# Altium project Arduino - FPGA Development Board.PrjPcb (part 2 of 2)

## Sheet Power.SchDoc
size A4
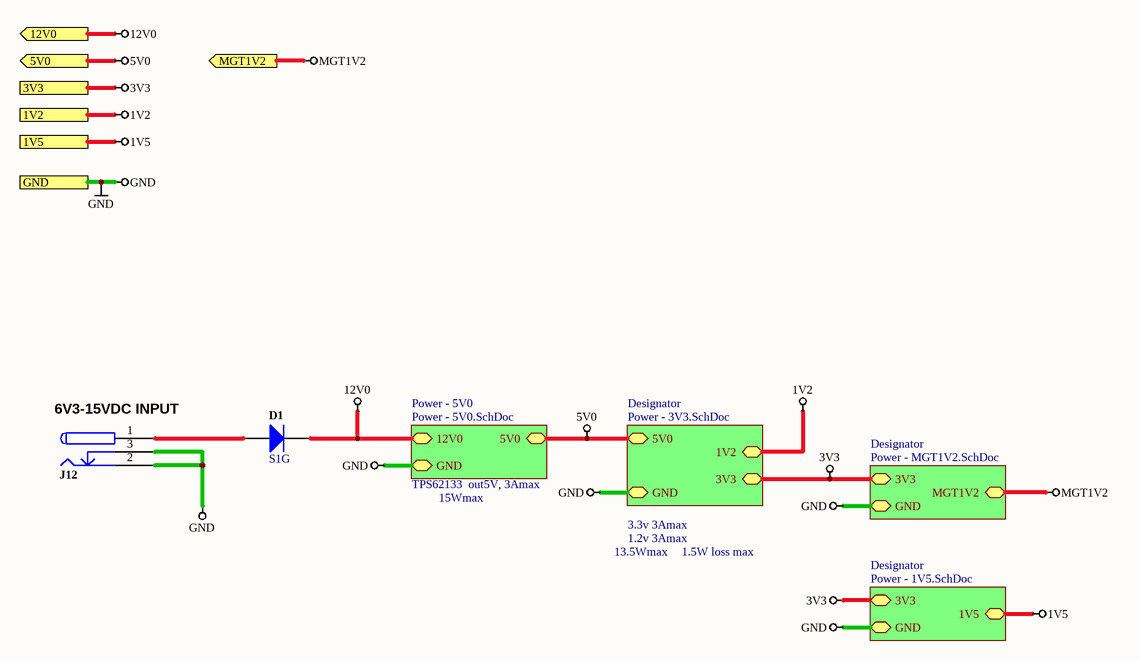
[diagram p10: Power.SchDoc]

### Parts
D1  S1G  [DO-214AC]
J12  PWR CONNECTOR  [PJ-102AH]  (value not drawn)

### Sub-sheets
Designator = Power - 3V3.SchDoc: 5V0, GND, 3V3, 1V2
Designator = Power - MGT1V2.SchDoc: 3V3, GND, MGT1V2
Designator = Power - 1V5.SchDoc: 3V3, GND, 1V5
Power - 5V0 = Power - 5V0.SchDoc: 12V0, GND, 5V0

### Ports
1V2, 1V5, 3V3, 5V0, 12V0, GND, MGT1V2

### Nets
1V2: port 1V2, sheet Designator/1V2
1V5: port 1V5, sheet Designator/1V5
3V3: port 3V3, sheet Designator/3V3, sheet Designator/3V3, sheet Designator/3V3
5V0: port 5V0, sheet Power - 5V0/5V0, sheet Designator/5V0
12V0: D1.2 ; port 12V0, sheet Power - 5V0/12V0
GND: J12.2 J12.3 ; port GND, sheet Power - 5V0/GND, sheet Designator/GND, sheet Designator/GND, sheet Designator/GND  [project net AGND]
MGT1V2: port MGT1V2, sheet Designator/MGT1V2
NetD1_1: D1.1 J12.1

### Notes on the sheet
- (near J12) 6V3-15VDC INPUT
- TPS62133  out5V, 3Amax
- 15Wmax
- 3.3v 3Amax
- 1.2v 3Amax
- 13.5Wmax
- 1.5W loss max

### Library data of the parts
D1 = S1G: Fairchild S1G General Purpose Rectifier; Vrrm: 400V; If(AV): 1.0A; Ifsm: 30A; Pd: 1.4W; Trr: 1.8uS; Ct: 6.6pF; Package: DO-214AC; Manufacturer_PN: S1G; Manufacturer Part Number: S1G
J12 = POWER-CONNECTOR-3: Connector, 3 Conductor Power Jack; Manufacturer_PN: CP-102AH-ND; Connector type: POWERJACK 3 HEADER; ClassName: PWR_CONN_5V0; Category: Connector; Mounting Technology: PTH; Pin Count: 3; Manufacturer Part Number: CP-102AH-ND

## Sheet Power - 5V0.SchDoc
size A4; PageSetup: Record=PageOptions|CenterHorizontal=True|CenterVertical=True|PrintScale=1.00|XCorrection=1.00|YCorrection=1.00|PrintKind=1|BorderSize=5000000|LeftOffset=0|BottomOffset=0|Orientation=2|PaperLength=1000|PaperWidth=1000|Scale=100|PaperSource=7|PrintQuality=-3|MediaType=1|DitherType=10|PrintScaleMode=1|PaperKind=Letter|PaperIndex=119
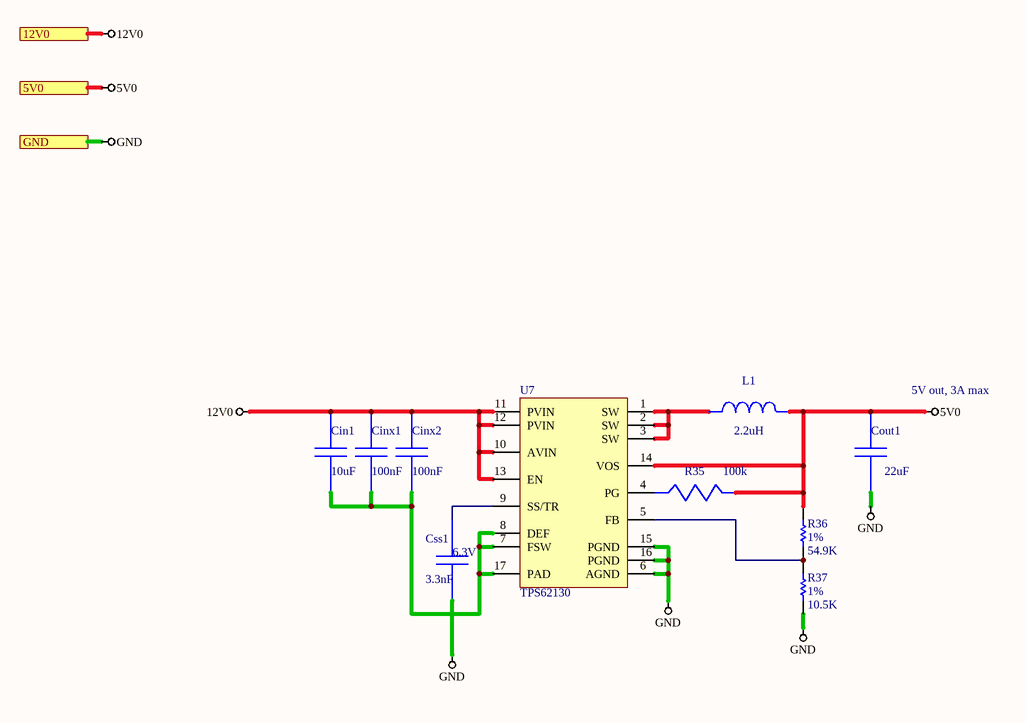
[diagram p11: Power - 5V0.SchDoc]

### Parts
Cin1  value 10uF  [1206]  (hidden comment: GRM31CR61E106KA12L)
Cinx1  value 100nF  [C-0603]  (hidden comment: C0603C104K3RACTU)
Cinx2  value 100nF  [C-0603]  (hidden comment: C0603C104K3RACTU)
Cout1  value 22uF  [C-0805]  (hidden comment: LMK212BJ226MG-T)
Css1  6.3V  value 3.3nF  [CAPC0402(1005)60_L]
L1  value 2.2uH  [XAL4020]  (hidden comment: XAL4020-222MEB)
R35  value 100k  [CAPC0402(1005)60_L]  (hidden comment: CRCW0402100KFKED)
R36  1%  value 54.9K  [RESC0402(1005)40_L]
R37  1%  value 10.5K  [RESC0402(1005)40_L]
U7  TPS62130  [S-PVQFN-N16]

### Ports
5V0, 12V0, GND

### Nets
5V0: Cout1.1 L1.2 R35.1 R36.2 U7.14(VOS) ; port 5V0
12V0: Cin1.1 Cinx1.1 Cinx2.1 U7.10(AVIN) U7.11(PVIN) U7.12(PVIN) U7.13(EN) ; port 12V0
GND: Cout1.2 Css1.2 R37.1 U7.6(AGND) U7.15(PGND) U7.16(PGND) ; port GND  [project net AGND]
NetCin1_2: Cin1.2 Cinx1.2 Cinx2.2 U7.7(FSW) U7.8(DEF) U7.17(PAD)
NetCss1_1: Css1.1 U7.9(SS/TR)
NetL1_1: L1.1 U7.1(SW) U7.2(SW) U7.3(SW)
NetR35_2: R35.2 U7.4(PG)
NetR36_1: R36.1 R37.2 U7.5(FB)

### Notes on the sheet
- (near Cout1) 5V out, 3A max

### Library data of the parts
Cin1 = GRM31CR61E106KA12L: GRM31CR61E106KA1; Manufacturer Name: MuRata; PackageReference: GRM31CR61E106KA12L; Manufacturer Part Number: GRM31CR61E106KA12L
Cinx1 Cinx2 = C0603C104K3RACTU: Manufacturer Name: Kemet; PackageReference: C0603C104K3RACTU; Manufacturer Part Number: C0603C104K3RACTU
Cout1 = LMK212BJ226MG-T: Manufacturer Name: Taiyo Yuden; PackageReference: LMK212BJ226MG-T; Manufacturer Part Number: LMK212BJ226MG-T
Css1 = GRM1555C1E621JA01D: GRM022R60J332KE19D; Manufacturer Name: MuRata; PackageReference: GRM022R60J332KE19D; Manufacturer Part Number: GRM022R60J332KE19D
L1 = XAL4020-222MEB: Manufacturer Name: Coilcraft; PackageReference: XAL4020-222MEB; Manufacturer Part Number: XAL4020-222MEB
R35 = CRCW0402100KFKED: Manufacturer Name: Vishay-Dale; PackageReference: CRCW0402100KFKED; Manufacturer Part Number: CRCW0402100KFKED
R36 R37 = Res1: Resistor; Published: 8-Jun-2000; LatestRevisionDate: 17-Jul-2002; LatestRevisionNote: Re-released for DXP Platform.; PackageReference: AXIAL-0.3; Publisher: Altium Limited; PackageDescription: Axial Device, Thru-Hole; 2 Leads; 0.3 in Pin Spacing
U7 = TPS6213X

## Sheet Power - 3V3.SchDoc
size A4
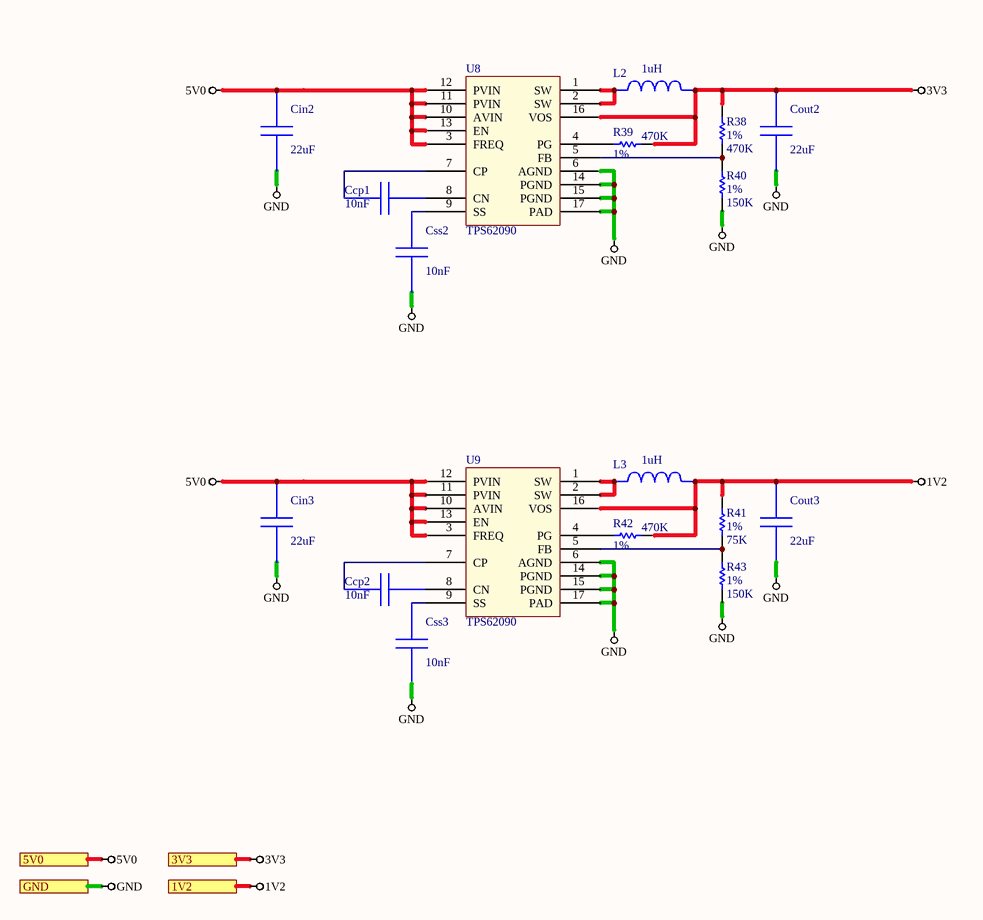
[diagram p12: Power - 3V3.SchDoc]

### Parts
Ccp1  value 10nF  [CAPC0402(1005)60_L]  (hidden comment: GRM155R71E103KA01D)
Ccp2  value 10nF  [CAPC0402(1005)60_L]  (hidden comment: GRM155R71E103KA01D)
Cin2  value 22uF  [C-0805]  (hidden comment: GRM21BR60J226ME39L)
Cin3  value 22uF  [C-0805]  (hidden comment: GRM21BR60J226ME39L)
Cout2  value 22uF  [C-0805]  (hidden comment: GRM21BR60J226ME39L)
Cout3  value 22uF  [C-0805]  (hidden comment: GRM21BR60J226ME39L)
Css2  value 10nF  [CAPC0402(1005)60_L]  (hidden comment: GRM155R71E103KA01D)
Css3  value 10nF  [CAPC0402(1005)60_L]  (hidden comment: GRM155R71E103KA01D)
L2  value 1uH  [XFL4020]  (hidden comment: XFL4020-102MEB)
L3  value 1uH  [XFL4020]  (hidden comment: XFL4020-102MEB)
R38  1%  value 470K  [RESC0402(1005)40_L]
R39  1%  value 470K  [RESC0402(1005)40_L]
R40  1%  value 150K  [RESC0402(1005)40_L]
R41  1%  value 75K  [RESC0402(1005)40_L]
R42  1%  value 470K  [RESC0402(1005)40_L]
R43  1%  value 150K  [RESC0402(1005)40_L]
U8  TPS62090  [RGT16_1P7X1P7]
U9  TPS62090  [RGT16_1P7X1P7]

### Ports
1V2, 3V3, 5V0, GND

### Nets
1V2: Cout3.1 L3.2 R41.2 R42.1 U9.16(VOS) ; port 1V2
3V3: Cout2.1 L2.2 R38.2 R39.1 U8.16(VOS) ; port 3V3
5V0: Cin2.1 Cin3.1 U8.3(FREQ) U8.10(AVIN) U8.11(PVIN) U8.12(PVIN) U8.13(EN) U9.3(FREQ) U9.10(AVIN) U9.11(PVIN) U9.12(PVIN) U9.13(EN) ; port 5V0
GND: Cin2.2 Cin3.2 Cout2.2 Cout3.2 Css2.2 Css3.2 R40.1 R43.1 U8.6(AGND) U8.14(PGND) U8.15(PGND) U8.17(PAD) U9.6(AGND) U9.14(PGND) U9.15(PGND) U9.17(PAD) ; port GND  [project net AGND]
NetCcp1_1: Ccp1.1 U8.7(CP)
NetCcp1_2: Ccp1.2 U8.8(CN)
NetCcp2_1: Ccp2.1 U9.7(CP)
NetCcp2_2: Ccp2.2 U9.8(CN)
NetCss2_1: Css2.1 U8.9(SS)
NetCss3_1: Css3.1 U9.9(SS)
NetL2_1: L2.1 U8.1(SW) U8.2(SW)
NetL3_1: L3.1 U9.1(SW) U9.2(SW)
NetR38_1: R38.1 R40.2 U8.5(FB)
NetR39_2: R39.2 U8.4(PG)
NetR41_1: R41.1 R43.2 U9.5(FB)
NetR42_2: R42.2 U9.4(PG)

### Library data of the parts
Ccp1 Ccp2 Css2 Css3 = GRM155R71E103KA01D: GRM155R71E103KA0; Manufacturer Name: MuRata; PackageReference: GRM155R71E103KA01D; Manufacturer Part Number: GRM155R71E103KA01D
Cin2 Cin3 Cout2 Cout3 = GRM21BR60J226ME39L: GRM21BR60J226ME3; Manufacturer Name: MuRata; PackageReference: GRM21BR60J226ME39L; Manufacturer Part Number: GRM21BR60J226ME39L
L2 L3 = Inductor-XFL4020-102MEB: Manufacturer Name: Coilcraft; Manufacturer Part Number: XFL4020-102MEB
R38-R43 = Res1: Resistor; Published: 8-Jun-2000; LatestRevisionDate: 17-Jul-2002; LatestRevisionNote: Re-released for DXP Platform.; PackageReference: AXIAL-0.3; Publisher: Altium Limited; PackageDescription: Axial Device, Thru-Hole; 2 Leads; 0.3 in Pin Spacing
U8 U9 = TPS6209X

## Sheet Power - MGT1V2.SchDoc
size A4
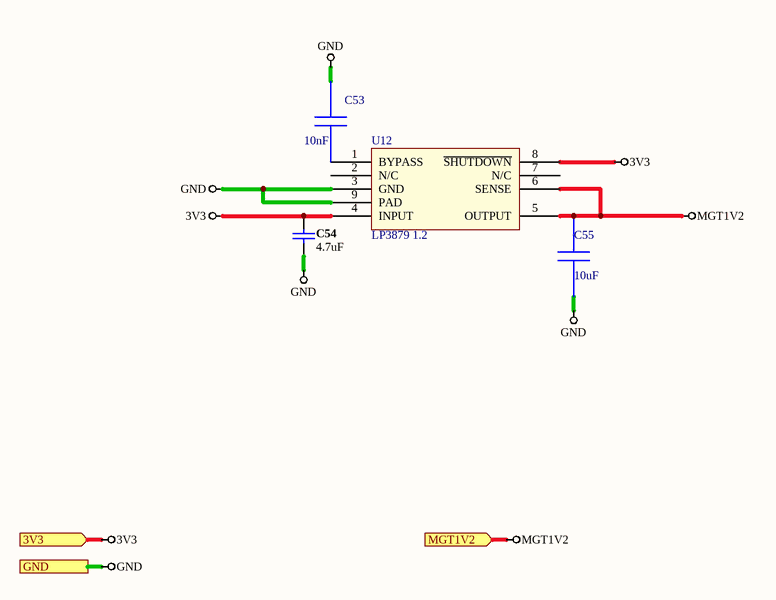
[diagram p13: Power - MGT1V2.SchDoc]

### Parts
C53  value 10nF  [CAPC0402(1005)60_L]  (hidden comment: GRM155R71E103KA01D)
C54  value 4.7uF  [CAPC0603(1608)55_L]  (hidden comment: CAP 4.7uF 10V 0603(1608))
C55  value 10uF  [1206]  (hidden comment: GRM31CR61E106KA12L)
U12  LP3879 1.2  [MRA08A]

### Ports
3V3, GND, MGT1V2

### Nets
3V3: C54.2 U12.4(INPUT) U12.8(~{SHUTDOWN}) ; port 3V3
GND: C53.1 C54.1 C55.2 U12.3(GND) U12.9(PAD) ; port GND  [project net AGND]
MGT1V2: C55.1 U12.5(OUTPUT) U12.6(SENSE) ; port MGT1V2
NetC53_2: C53.2 U12.1(BYPASS)

Not connected (* = marked no-connect by the designer): U12 2(N/C) 7(N/C)

### Library data of the parts
C53 = GRM155R71E103KA01D: as Ccp1 on sheet Power - 3V3; PackageReference: GRM155R71E103KA01D; Manufacturer Part Number: GRM155R71E103KA01D
C54 = CAP 4.7uF 10V ±10% 0603 (1608 Metric) Thickness 0.55mm SMD: Manufacturer_PN: CC0603KRX5R6BB475; Case-Metric: 1608; Case-EIA: 0603; Tolerance: ±10%; Rated Voltage: 10 V; Technology: SMT; Max Thickness: 0.55 mm; Manufacturer Part Number: CC0603KRX5R6BB475
C55 = GRM31CR61E106KA12L: as Cin1 on sheet Power - 5V0; PackageReference: GRM31CR61E106KA12L; Manufacturer Part Number: GRM31CR61E106KA12L
U12 = LP3879

## Sheet Power - 1V5.SchDoc
size A4
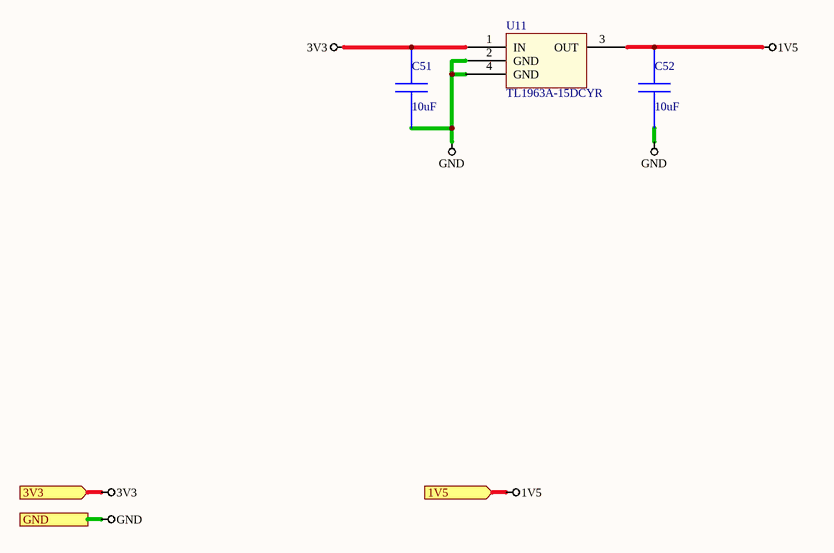
[diagram p14: Power - 1V5.SchDoc]

### Parts
C51  value 10uF  [1206]  (hidden comment: GRM31CR61E106KA12L)
C52  value 10uF  [1206]  (hidden comment: GRM31CR61E106KA12L)
U11  TL1963A-15DCYR  [DCY4]

### Ports
1V5, 3V3, GND

### Nets
1V5: C52.1 U11.3(OUT) ; port 1V5
3V3: C51.1 U11.1(IN) ; port 3V3
GND: C51.2 C52.2 U11.2(GND) U11.4(GND) ; port GND  [project net AGND]

### Library data of the parts
C51 C52 = GRM31CR61E106KA12L: as Cin1 on sheet Power - 5V0; PackageReference: GRM31CR61E106KA12L; Manufacturer Part Number: GRM31CR61E106KA12L

## Sheet LEDS - Status.SchDoc
size A4
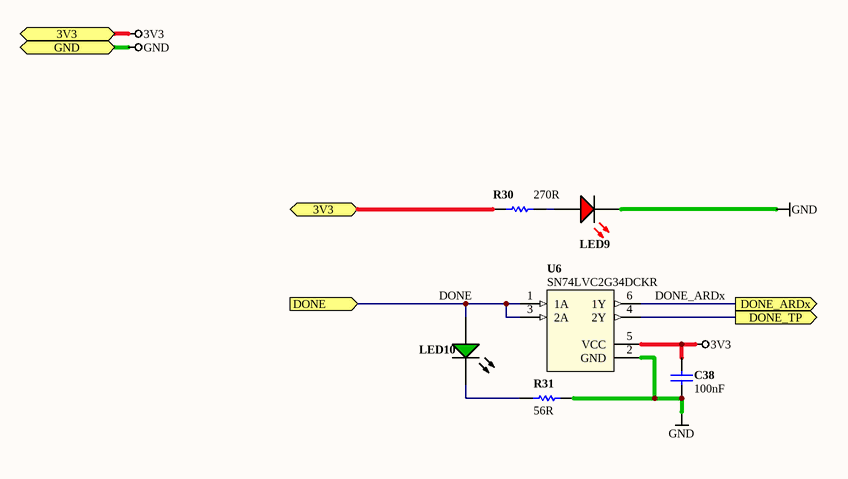
[diagram p15: LEDS - Status.SchDoc]

### Parts
C38  value 100nF  [CAPC0402(1005)60_L]  (hidden comment: CAP 100nF 10V 0402(1005))
LED9  0402-LED-RED  [LED_0402]  (value not drawn)
LED10  LED_GREEN_APT1608SGC  [LED0603]  (value not drawn)
R30  value 270R  [RESC0402(1005)40_L]  (hidden comment: 270R 1 0402)
R31  value 56R  [RESC0402(1005)_L]  (hidden comment: 56R 1% 0402(1005))
U6  SN74LVC2G34DCKR  [TI-DCK6_L]

### Ports
3V3, DONE (in), DONE_ARDx (out), DONE_TP (out), GND

### Nets
3V3: C38.2 R30.1 U6.5(VCC) ; port 3V3
GND: C38.1 LED9.2(K) R31.2 U6.2(GND) ; port GND  [project net AGND]
DONE: LED10.1(A) U6.1(1A) U6.3(2A) ; port DONE
DONE_ARDx: U6.6(1Y) ; port DONE_ARDx
NetLED9_1: LED9.1(A) R30.2
NetLED10_2: LED10.2(K) R31.1
NetU6_4: U6.4(2Y) ; port DONE_TP

### Library data of the parts
C38 = CMP-1034-02064-1: CAP 100nF 10V ±5% 0402 (1005 Metric) Thickness 0.6mm SMD; Manufacturer_PN: C0402C104K8PACTU; Case-EIA: 0402; Case-Metric: 1005; Max Thickness: 0.6 mm; Tolerance: ±5%; Rated Voltage: 10 V; Technology: SMT; Manufacturer Part Number: C0402C104K8PACTU
LED9 = CMP-0201-0013: 0402 LED,RED; Manufacturer_PN: LTST-C190KRKT; DefaultDesignator: LED?; Class: Diodes; Current Average (Io): 1.8V; ID: CMP-0201-0013; Sub Class: LED; Reverse Voltage DC (Vr): Red; ComponentLink1Description: Datasheet; ComponentLink1URL: http://optoelectronics.liteon.com/upload/download/DS-22-99-0151/S_110_LTST-C190KRKT.pdf; ComponentLink2Description: Manufacturer; ComponentLink2URL: www.liteon.com; Manufacturer Part Number: LTST-C190KRKT
LED10 = LED_GREEN_APT1608SGC: SMD 0603 LED, GREEN; DefaultDesignator: LED?; Class: Diodes; Forward Voltage (Vf): 2.2V; PartNumber: APT1608SGC; Sub Class: LED; Color: Green; Manufacturer_PN: APT1608SGC; Manufacturer Part Number: APT1608SGC
R30 = CMP-0503-0059: 0402 (1005 Metric) 1/16 W 270R 1 Thick Film Chip Resistor; Manufacturer_PN: RC1005F271CS; Case-EIA: 0402; Case-Metric: 1005; Temp Coefficient ppm/°C: ±100; Tolerance %: 1%; Value (Ohms): 270; Power: 1/16 W; ID: CMP-0503-0059; Technology: SMT; Manufacturer Part Number: RC1005F271CS
R31 = CMP-1011-00369-1: 56R 0.063W 1% 0402 (1005 Metric)  SMD; Manufacturer_PN: RC0402FR-0756RL; Case-Metric: 1005; Case-EIA: 0402; Power: 0.063 W; Tolerance: 1 %; Technology: SMT; Manufacturer Part Number: RC0402FR-0756RL
U6 = SN74LVC2G34DCKR: IC BUFFER DUAL NON-INV SC706; Manufacturer: Texas Instruments; DefaultDesignator: U?; Class: Logic; Sub Class: Buffer-Line Driver; Description2: IC BUFF/DVR TRI-ST OCTAL 20-VQFN; Logic Type: Buffer/Line Driver, Non-Inverting; Number of Elements: 2; Number of Bits per Element: 4; Current - Output High, Low: 24mA, 24mA; Voltage - Supply: 1.65 V ~ 3.6 V; PartNumber: SN74LVC2G34DCKR; ComponentLink1Description: Datasheet; ComponentLink1URL: http://www.ti.com/lit/ds/symlink/sn74lvc2g34.pdf; ComponentLink2Description: Manufacturer; ComponentLink2URL: www.ti.com; Series: 74LVC; Operating Temperature: -40°C ~ 125°C; Manufacturer_PN: SN74LVC2G34DCKR; Manufacturer Part Number: SN74LVC2G34DCKR

## Nets that join several sheets
1V5: PCIE - mini-pcie-connector (5 pins), Power - 1V5 (C52.1 U11.3)
3V3: Arduino FPGA Top-Level Interface (J1.9 J9.2), Arduino FPGA Design (C8.1 R19.2 U2.4), FPGA - XC6SLX45T-2CSG324C (10 pins), PCIE - mini-pcie-connector (11 pins), GPS - NEO-M8T (5 pins), Power - 3V3 (5 pins), Power - MGT1V2 (C54.2 U12.4 U12.8), Power - 1V5 (C51.1 U11.1), LEDS - Status (C38.2 R30.1 U6.5)
5V0: Arduino FPGA Top-Level Interface (J10.2), Power - 5V0 (5 pins), Power - 3V3 (12 pins)
12V0: Arduino FPGA Top-Level Interface (J11.2), Power (D1.2), Power - 5V0 (7 pins)
AGND: Arduino FPGA Top-Level Interface (13 pins), Arduino FPGA Design (C8.2 R18.1 U2.2), Flash - M25P32-VMW6TG (C10.2 U4.4), FPGA - XC6SLX45T-2CSG324C (27 pins), FPGA - Decoupling (69 pins), Arduino FPGA SPI MUX (C9.2 U3.8), SRAM0 - IS61WV12816DBLL-10BLI (6 pins), PCIE - mini-pcie-connector (19 pins), GPS - NEO-M8T (15 pins), Power (J12.2 J12.3), Power - 5V0 (6 pins), Power - 3V3 (16 pins), Power - MGT1V2 (5 pins), Power - 1V5 (C51.2 C52.2 U11.2 U11.4), LEDS - Status (C38.1 LED9.2 R31.2 U6.2)
MGT1V2: FPGA - XC6SLX45T-2CSG324C (14 pins), Power - MGT1V2 (C55.1 U12.5 U12.6)
PWR: Flash - M25P32-VMW6TG (C10.1 R28.2 R29.2 U4.8), Arduino FPGA SPI MUX (C9.1 U3.16), SRAM0 - IS61WV12816DBLL-10BLI (6 pins)
ARD_A0: Arduino FPGA Top-Level Interface (J7.1), FPGA - XC6SLX45T-2CSG324C (U1.C15)
ARD_A1: Arduino FPGA Top-Level Interface (J7.2), FPGA - XC6SLX45T-2CSG324C (U1.D15)
ARD_A2: Arduino FPGA Top-Level Interface (J7.3), FPGA - XC6SLX45T-2CSG324C (U1.E14)
ARD_A3: Arduino FPGA Top-Level Interface (J7.4), FPGA - XC6SLX45T-2CSG324C (U1.F12)
ARD_A4: Arduino FPGA Top-Level Interface (J7.5), FPGA - XC6SLX45T-2CSG324C (U1.E12)
ARD_A5: Arduino FPGA Top-Level Interface (J7.6), FPGA - XC6SLX45T-2CSG324C (U1.G11)
ARD_D0(RX): Arduino FPGA Top-Level Interface (J5.1), FPGA - XC6SLX45T-2CSG324C (U1.C1)
ARD_D1(TX): Arduino FPGA Top-Level Interface (J5.2), FPGA - XC6SLX45T-2CSG324C (U1.C2)
ARD_D4: Arduino FPGA Top-Level Interface (J5.5), FPGA - XC6SLX45T-2CSG324C (U1.D1)
ARD_D5: Arduino FPGA Top-Level Interface (J5.6), FPGA - XC6SLX45T-2CSG324C (U1.D2)
ARD_D6: Arduino FPGA Top-Level Interface (J5.7), FPGA - XC6SLX45T-2CSG324C (U1.E1)
ARD_D7: Arduino FPGA Top-Level Interface (J5.8), FPGA - XC6SLX45T-2CSG324C (U1.F1)
ARD_D8: Arduino FPGA Top-Level Interface (J6.1), FPGA - XC6SLX45T-2CSG324C (U1.F2)
ARD_D9: Arduino FPGA Top-Level Interface (J6.2), FPGA - XC6SLX45T-2CSG324C (U1.G1)
ARD_D10: Arduino FPGA Top-Level Interface (J6.3), FPGA - XC6SLX45T-2CSG324C (U1.H1), Arduino FPGA SPI MUX (U3.13)
ARD_D11: Arduino FPGA Top-Level Interface (J6.4), FPGA - XC6SLX45T-2CSG324C (U1.H2)
ARD_D12: Arduino FPGA Top-Level Interface (J6.5), FPGA - XC6SLX45T-2CSG324C (U1.J1)
ARD_D13: Arduino FPGA Top-Level Interface (J6.6), FPGA - XC6SLX45T-2CSG324C (U1.K1)
CCLK: FPGA - XC6SLX45T-2CSG324C (R1.1 R3.2 U1.R15), Arduino FPGA SPI MUX (U3.11)
CS_FL_N: Flash - M25P32-VMW6TG (U4.1), Arduino FPGA SPI MUX (U3.12)
CSO_B_FPGA: FPGA - XC6SLX45T-2CSG324C (R17.1 U1.V3), Arduino FPGA SPI MUX (U3.14)
D_SEL: FPGA - XC6SLX45T-2CSG324C (U1.V4), GPS - NEO-M8T (U10.2)
DONE: FPGA - XC6SLX45T-2CSG324C (R9.1 U1.V17), LEDS - Status (LED10.1 U6.1 U6.3)
GPS_RESET: FPGA - XC6SLX45T-2CSG324C (U1.R10), GPS - NEO-M8T (R46.2 U10.8)
HARD_TCK: Arduino FPGA Top-Level Interface (J1.1), FPGA - XC6SLX45T-2CSG324C (R4.1 R11.1)
HARD_TDI: Arduino FPGA Top-Level Interface (J1.3), FPGA - XC6SLX45T-2CSG324C (R5.1 R12.1)
HARD_TDO: Arduino FPGA Top-Level Interface (J1.5), FPGA - XC6SLX45T-2CSG324C (R6.1 R13.1)
HARD_TMS: Arduino FPGA Top-Level Interface (J1.7), FPGA - XC6SLX45T-2CSG324C (R7.1 R14.1)
HOLD_N: Arduino FPGA Top-Level Interface (TP3.1), Flash - M25P32-VMW6TG (R29.1 U4.7)
INIT_B: Arduino FPGA Top-Level Interface (TP4.1), FPGA - XC6SLX45T-2CSG324C (R16.1 U1.U3)
IO0: Arduino FPGA Top-Level Interface (R20.2), FPGA - XC6SLX45T-2CSG324C (U1.U8)
IO1: Arduino FPGA Top-Level Interface (R21.2), FPGA - XC6SLX45T-2CSG324C (U1.V16)
IO2: Arduino FPGA Top-Level Interface (R22.2), FPGA - XC6SLX45T-2CSG324C (U1.V14)
IO3: Arduino FPGA Top-Level Interface (R23.2), FPGA - XC6SLX45T-2CSG324C (U1.V13)
IO4: Arduino FPGA Top-Level Interface (R24.2), FPGA - XC6SLX45T-2CSG324C (U1.V12)
IO5: Arduino FPGA Top-Level Interface (R25.2), FPGA - XC6SLX45T-2CSG324C (U1.U11)
IO6: Arduino FPGA Top-Level Interface (R26.2), FPGA - XC6SLX45T-2CSG324C (U1.V9)
IO7: Arduino FPGA Top-Level Interface (R27.2), FPGA - XC6SLX45T-2CSG324C (U1.V10)
MISO_ARD: Arduino FPGA Top-Level Interface (J2.1), FPGA - XC6SLX45T-2CSG324C (U1.A15), Arduino FPGA SPI MUX (U3.3)
MISO_FL: Flash - M25P32-VMW6TG (U4.2), Arduino FPGA SPI MUX (U3.4)
MISO_FPGA: FPGA - XC6SLX45T-2CSG324C (U1.R13), Arduino FPGA SPI MUX (U3.2)
MOSI_ARD: Arduino FPGA Top-Level Interface (J2.4), FPGA - XC6SLX45T-2CSG324C (U1.B16), Arduino FPGA SPI MUX (U3.6)
MOSI_FL: Flash - M25P32-VMW6TG (U4.5), Arduino FPGA SPI MUX (U3.7)
MOSI_FPGA: FPGA - XC6SLX45T-2CSG324C (U1.T13), Arduino FPGA SPI MUX (U3.5)
MUX_SEL: Arduino FPGA Top-Level Interface (J5.3), Arduino FPGA Design (R18.2), FPGA - XC6SLX45T-2CSG324C (U1.U1)
PCIE_CLK_N: FPGA - XC6SLX45T-2CSG324C (U1.A8), PCIE - mini-pcie-connector (CN1.11)
PCIE_CLK_P: FPGA - XC6SLX45T-2CSG324C (U1.B8), PCIE - mini-pcie-connector (CN1.13)
PCIE_PERST: FPGA - XC6SLX45T-2CSG324C (U1.A3), PCIE - mini-pcie-connector (CN1.22 R34.2)
PCIE_RX0_N: FPGA - XC6SLX45T-2CSG324C (U1.C5), PCIE - mini-pcie-connector (CN1.23)
PCIE_RX0_P: FPGA - XC6SLX45T-2CSG324C (U1.D5), PCIE - mini-pcie-connector (CN1.25)
PCIE_SMB_CLK: FPGA - XC6SLX45T-2CSG324C (U1.E8), PCIE - mini-pcie-connector (CN1.30)
PCIE_SMB_DATA: FPGA - XC6SLX45T-2CSG324C (U1.G9), PCIE - mini-pcie-connector (CN1.32)
PCIE_TX0_N: FPGA - XC6SLX45T-2CSG324C (U1.A4), PCIE - mini-pcie-connector (C42.1)
PCIE_TX0_P: FPGA - XC6SLX45T-2CSG324C (U1.B4), PCIE - mini-pcie-connector (C43.1)
PCIE_USB_DN: FPGA - XC6SLX45T-2CSG324C (U1.F7), PCIE - mini-pcie-connector (CN1.36)
PCIE_USB_DP: FPGA - XC6SLX45T-2CSG324C (U1.E6), PCIE - mini-pcie-connector (CN1.38)
PCIE_W_DISABLE: FPGA - XC6SLX45T-2CSG324C (U1.A2), PCIE - mini-pcie-connector (CN1.20 R33.2)
PCIE_WAKE: FPGA - XC6SLX45T-2CSG324C (U1.B3), PCIE - mini-pcie-connector (CN1.1 R32.2)
PROGRAM_B: Arduino FPGA Top-Level Interface (J5.4), FPGA - XC6SLX45T-2CSG324C (R8.1 U1.V2)
RxD_SPI_MOSI: FPGA - XC6SLX45T-2CSG324C (U1.V5), GPS - NEO-M8T (U10.21)
SCL_SPI_CLK: FPGA - XC6SLX45T-2CSG324C (U1.U5), GPS - NEO-M8T (U10.19)
SCLK_ARD: Arduino FPGA Top-Level Interface (J2.3), FPGA - XC6SLX45T-2CSG324C (U1.A16), Arduino FPGA SPI MUX (U3.10)
SCLK_FL: Flash - M25P32-VMW6TG (U4.6), Arduino FPGA SPI MUX (U3.9)
SDA_SPI_CS_N: FPGA - XC6SLX45T-2CSG324C (U1.V6), GPS - NEO-M8T (U10.18)
SRAM0_CS_N: FPGA - XC6SLX45T-2CSG324C (U1.F16), SRAM0 - IS61WV12816DBLL-10BLI (U5.B5)
SRAM0_HBE_N: FPGA - XC6SLX45T-2CSG324C (U1.L15), SRAM0 - IS61WV12816DBLL-10BLI (U5.B2)
SRAM0_LBE_N: FPGA - XC6SLX45T-2CSG324C (U1.L16), SRAM0 - IS61WV12816DBLL-10BLI (U5.A1)
SRAM0_OE_N: FPGA - XC6SLX45T-2CSG324C (U1.K16), SRAM0 - IS61WV12816DBLL-10BLI (U5.A2)
SRAM0_WE_N: FPGA - XC6SLX45T-2CSG324C (U1.P17), SRAM0 - IS61WV12816DBLL-10BLI (U5.G5)
SRAM_A0: FPGA - XC6SLX45T-2CSG324C (U1.J16), SRAM0 - IS61WV12816DBLL-10BLI (U5.A3)
SRAM_A1: FPGA - XC6SLX45T-2CSG324C (U1.H15), SRAM0 - IS61WV12816DBLL-10BLI (U5.A4)
SRAM_A2: FPGA - XC6SLX45T-2CSG324C (U1.F17), SRAM0 - IS61WV12816DBLL-10BLI (U5.A5)
SRAM_A3: FPGA - XC6SLX45T-2CSG324C (U1.H16), SRAM0 - IS61WV12816DBLL-10BLI (U5.B3)
SRAM_A4: FPGA - XC6SLX45T-2CSG324C (U1.F18), SRAM0 - IS61WV12816DBLL-10BLI (U5.B4)
SRAM_A5: FPGA - XC6SLX45T-2CSG324C (U1.K15), SRAM0 - IS61WV12816DBLL-10BLI (U5.C3)
SRAM_A6: FPGA - XC6SLX45T-2CSG324C (U1.G16), SRAM0 - IS61WV12816DBLL-10BLI (U5.C4)
SRAM_A7: FPGA - XC6SLX45T-2CSG324C (U1.C17), SRAM0 - IS61WV12816DBLL-10BLI (U5.D4)
SRAM_A8: FPGA - XC6SLX45T-2CSG324C (U1.J18), SRAM0 - IS61WV12816DBLL-10BLI (U5.H2)
SRAM_A9: FPGA - XC6SLX45T-2CSG324C (U1.K18), SRAM0 - IS61WV12816DBLL-10BLI (U5.H3)
SRAM_A10: FPGA - XC6SLX45T-2CSG324C (U1.L18), SRAM0 - IS61WV12816DBLL-10BLI (U5.H4)
SRAM_A11: FPGA - XC6SLX45T-2CSG324C (U1.N18), SRAM0 - IS61WV12816DBLL-10BLI (U5.H5)
SRAM_A12: FPGA - XC6SLX45T-2CSG324C (U1.L17), SRAM0 - IS61WV12816DBLL-10BLI (U5.G3)
SRAM_A13: FPGA - XC6SLX45T-2CSG324C (U1.M18), SRAM0 - IS61WV12816DBLL-10BLI (U5.G4)
SRAM_A14: FPGA - XC6SLX45T-2CSG324C (U1.K17), SRAM0 - IS61WV12816DBLL-10BLI (U5.F3)
SRAM_A15: FPGA - XC6SLX45T-2CSG324C (U1.N17), SRAM0 - IS61WV12816DBLL-10BLI (U5.F4)
SRAM_A16: FPGA - XC6SLX45T-2CSG324C (U1.U18), SRAM0 - IS61WV12816DBLL-10BLI (U5.E4)
SRAM_A17: FPGA - XC6SLX45T-2CSG324C (U1.P16), SRAM0 - IS61WV12816DBLL-10BLI (U5.D3)
SRAM_D0: FPGA - XC6SLX45T-2CSG324C (U1.E16), SRAM0 - IS61WV12816DBLL-10BLI (U5.B6)
SRAM_D1: FPGA - XC6SLX45T-2CSG324C (U1.D18), SRAM0 - IS61WV12816DBLL-10BLI (U5.C5)
SRAM_D2: FPGA - XC6SLX45T-2CSG324C (U1.D17), SRAM0 - IS61WV12816DBLL-10BLI (U5.C6)
SRAM_D3: FPGA - XC6SLX45T-2CSG324C (U1.C18), SRAM0 - IS61WV12816DBLL-10BLI (U5.D5)
SRAM_D4: FPGA - XC6SLX45T-2CSG324C (U1.U17), SRAM0 - IS61WV12816DBLL-10BLI (U5.E5)
SRAM_D5: FPGA - XC6SLX45T-2CSG324C (U1.T17), SRAM0 - IS61WV12816DBLL-10BLI (U5.F5)
SRAM_D6: FPGA - XC6SLX45T-2CSG324C (U1.T18), SRAM0 - IS61WV12816DBLL-10BLI (U5.F6)
SRAM_D7: FPGA - XC6SLX45T-2CSG324C (U1.P18), SRAM0 - IS61WV12816DBLL-10BLI (U5.G6)
SRAM_D8: FPGA - XC6SLX45T-2CSG324C (U1.M16), SRAM0 - IS61WV12816DBLL-10BLI (U5.B1)
SRAM_D9: FPGA - XC6SLX45T-2CSG324C (U1.N16), SRAM0 - IS61WV12816DBLL-10BLI (U5.C1)
SRAM_D10: FPGA - XC6SLX45T-2CSG324C (U1.N15), SRAM0 - IS61WV12816DBLL-10BLI (U5.C2)
SRAM_D11: FPGA - XC6SLX45T-2CSG324C (U1.P15), SRAM0 - IS61WV12816DBLL-10BLI (U5.D2)
SRAM_D12: FPGA - XC6SLX45T-2CSG324C (U1.E18), SRAM0 - IS61WV12816DBLL-10BLI (U5.E2)
SRAM_D13: FPGA - XC6SLX45T-2CSG324C (U1.H17), SRAM0 - IS61WV12816DBLL-10BLI (U5.F2)
SRAM_D14: FPGA - XC6SLX45T-2CSG324C (U1.G18), SRAM0 - IS61WV12816DBLL-10BLI (U5.F1)
SRAM_D15: FPGA - XC6SLX45T-2CSG324C (U1.H18), SRAM0 - IS61WV12816DBLL-10BLI (U5.G1)
TIMPULSE1: FPGA - XC6SLX45T-2CSG324C (U1.U7), GPS - NEO-M8T (R45.1 U10.3)
TIMPULSE2: FPGA - XC6SLX45T-2CSG324C (U1.V8), GPS - NEO-M8T (U10.1)
TxD_SPI_MISO: FPGA - XC6SLX45T-2CSG324C (U1.V7), GPS - NEO-M8T (U10.20)
WP_N: Arduino FPGA Top-Level Interface (TP2.1), Flash - M25P32-VMW6TG (R28.1 U4.3)